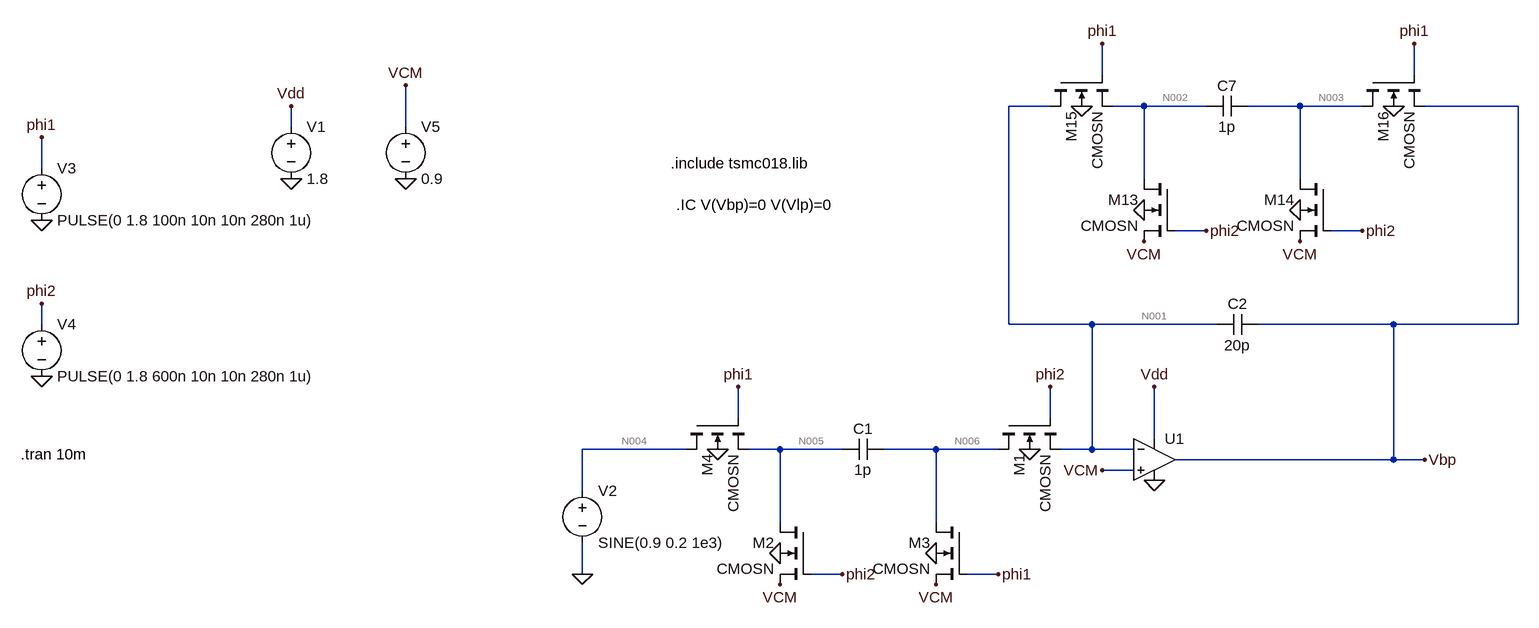
[diagram p0: schematic filtro1G2.asc]
filtro1G2.asc, the LTspice schematic file:
Version 4
SHEET 1 3232 680
WIRE 384 -368 384 -416
WIRE 864 -368 864 -416
WIRE 304 -320 240 -320
WIRE 448 -320 400 -320
WIRE 544 -320 448 -320
WIRE 688 -320 608 -320
WIRE 784 -320 688 -320
WIRE 1024 -320 880 -320
WIRE -864 -288 -864 -320
WIRE -688 -288 -688 -352
WIRE -1248 -224 -1248 -272
WIRE 448 -208 448 -320
WIRE 688 -208 688 -320
WIRE 544 -128 496 -128
WIRE 784 -128 736 -128
WIRE 448 -112 448 -128
WIRE -1248 16 -1248 -16
WIRE 240 16 240 -320
WIRE 368 16 240 16
WIRE 560 16 368 16
WIRE 832 16 624 16
WIRE 1024 16 1024 -320
WIRE 1024 16 832 16
WIRE -176 160 -176 112
WIRE 304 160 304 112
WIRE 464 192 464 112
WIRE -256 208 -416 208
WIRE -112 208 -160 208
WIRE -16 208 -112 208
WIRE 128 208 48 208
WIRE 224 208 128 208
WIRE 368 208 368 16
WIRE 368 208 320 208
WIRE 432 208 368 208
WIRE 832 224 832 16
WIRE 832 224 496 224
WIRE 880 224 832 224
WIRE 432 240 384 240
WIRE -416 272 -416 208
WIRE -112 320 -112 208
WIRE 128 320 128 208
WIRE -416 400 -416 352
WIRE -16 400 -64 400
WIRE 224 400 176 400
WIRE -112 416 -112 400
FLAG 464 256 0
FLAG -864 -208 0
FLAG -864 -320 Vdd
FLAG 464 112 Vdd
FLAG -1248 96 0
FLAG -1248 -144 0
FLAG -1248 -272 phi1
FLAG -176 112 phi1
FLAG -1248 -16 phi2
FLAG -208 208 0
FLAG -112 368 0
FLAG 128 368 0
FLAG 272 208 0
FLAG -16 400 phi2
FLAG 384 -416 phi1
FLAG 352 -320 0
FLAG 448 -160 0
FLAG 688 -160 0
FLAG 832 -320 0
FLAG 864 -416 phi1
FLAG 544 -128 phi2
FLAG 784 -128 phi2
FLAG 880 224 Vbp
FLAG -416 400 0
FLAG -688 -208 0
FLAG -688 -352 VCM
FLAG 384 240 VCM
FLAG -112 416 VCM
FLAG 128 416 VCM
FLAG 448 -112 VCM
FLAG 688 -112 VCM
FLAG 224 400 phi1
FLAG 304 112 phi2
SYMBOL OpAmps\\UniversalOpAmp2 464 224 R0
SYMATTR InstName U1
SYMATTR Value2 Avol=1Meg GBW=10Meg Slew=100Meg
SYMATTR SpiceLine2 En=0 Enk=0 In=0 Ink=0 Rin=5000Meg
SYMBOL cap 48 192 R90
WINDOW 0 0 32 VBottom 2
WINDOW 3 32 32 VTop 2
SYMATTR InstName C1
SYMATTR Value 1p
SYMBOL voltage -864 -304 R0
WINDOW 123 0 0 Left 0
WINDOW 39 0 0 Left 0
SYMATTR InstName V1
SYMATTR Value 1.8
SYMBOL voltage -1248 -240 R0
WINDOW 123 0 0 Left 0
WINDOW 39 0 0 Left 0
SYMATTR InstName V3
SYMATTR Value PULSE(0 1.8 100n 10n 10n 280n 1u)
SYMBOL cap 624 0 R90
WINDOW 0 0 32 VBottom 2
WINDOW 3 32 32 VTop 2
SYMATTR InstName C2
SYMATTR Value 20p
SYMBOL voltage -1248 0 R0
WINDOW 123 0 0 Left 0
WINDOW 39 0 0 Left 0
SYMATTR InstName V4
SYMATTR Value PULSE(0 1.8 600n 10n 10n 280n 1u)
SYMBOL cmosn -64 320 M0
SYMATTR InstName M2
SYMATTR Value2 l=500n w=2u
SYMBOL cmosn 176 320 M0
SYMATTR InstName M3
SYMATTR Value2 l=500n w=2u
SYMBOL cmosn -256 160 M90
SYMATTR InstName M4
SYMATTR Value2 l=500n w=2u
SYMBOL cmosn 224 160 M90
SYMATTR InstName M1
SYMATTR Value2 l=500n w=2u
SYMBOL cap 608 -336 R90
WINDOW 0 0 32 VBottom 2
WINDOW 3 32 32 VTop 2
SYMATTR InstName C7
SYMATTR Value 1p
SYMBOL cmosn 496 -208 M0
SYMATTR InstName M13
SYMATTR Value2 l=500n w=2u
SYMBOL cmosn 736 -208 M0
SYMATTR InstName M14
SYMATTR Value2 l=500n w=2u
SYMBOL cmosn 304 -368 M90
SYMATTR InstName M15
SYMATTR Value2 l=500n w=2u
SYMBOL cmosn 784 -368 M90
SYMATTR InstName M16
SYMATTR Value2 l=500n w=2u
SYMBOL voltage -416 256 R0
WINDOW 123 0 0 Left 0
WINDOW 39 0 0 Left 0
SYMATTR InstName V2
SYMATTR Value SINE(0.9 0.2 1e3)
SYMBOL voltage -688 -304 R0
WINDOW 123 0 0 Left 0
WINDOW 39 0 0 Left 0
SYMATTR InstName V5
SYMATTR Value 0.9
TEXT -280 -232 Left 2 !.include tsmc018.lib
TEXT -1280 216 Left 2 !.tran 10m
TEXT -272 -168 Left 2 !.IC V(Vbp)=0 V(Vlp)=0

The netlist it stands for:
* filtro1G2.asc
XU1 VCM N001 Vdd 0 Vbp level2 Avol=1Meg GBW=10Meg Slew=100Meg Ilimit=25m Rail=0 Vos=0 En=0 Enk=0 In=0 Ink=0 Rin=5000Meg  ; pins In+ In- V+ V- OUT
C1 N006 N005 1p
V1 Vdd 0 1.8
V3 phi1 0 PULSE(0 1.8 100n 10n 10n 280n 1u)
C2 Vbp N001 20p
V4 phi2 0 PULSE(0 1.8 600n 10n 10n 280n 1u)
M2 N005 phi2 VCM 0 CMOSN l=500n w=2u
M3 N006 phi1 VCM 0 CMOSN l=500n w=2u
M4 N004 phi1 N005 0 CMOSN l=500n w=2u
M1 N006 phi2 N001 0 CMOSN l=500n w=2u
C7 N003 N002 1p
M13 N002 phi2 VCM 0 CMOSN l=500n w=2u
M14 N003 phi2 VCM 0 CMOSN l=500n w=2u
M15 N001 phi1 N002 0 CMOSN l=500n w=2u
M16 N003 phi1 Vbp 0 CMOSN l=500n w=2u
V2 N004 0 SINE(0.9 0.2 1e3)
V5 VCM 0 0.9
.model NMOS NMOS
.model PMOS PMOS
.lib standard.mos
.include tsmc018.lib
.tran 10m
.IC V(Vbp)=0 V(Vlp)=0
.lib UniversalOpAmp2.lib
.backanno
.end

* Results of the author's LTspice run, read from the files saved beside the schematic
* Operating Point, zero values left out:
*   V(vdd) = 1.8 V
*   V(n001) = 889.8 mV
*   V(vcm) = 900 mV
*   V(n006) = 109.9 mV
*   V(n005) = 109.9 mV
*   V(n004) = 900 mV
*   V(n003) = 19.47 mV
*   V(n002) = 109.9 mV
*   Id(M16) = 3.768 pA
*   Is(M16) = -3.743 pA
*   Id(M15) = 1.019 pA
*   Ib(M15) = -1.02 pA
*   Id(M14) = -3.768 pA
*   Is(M14) = 4.702 pA
*   Ib(M13) = -1.03 pA
*   Is(M13) = 1.03 pA
*   Ib(M1) = -1.02 pA
*   Is(M1) = 1.019 pA
*   Id(M4) = 1.03 pA
*   Ib(M4) = -1.03 pA
*   Ib(M3) = -1.03 pA
*   Is(M3) = 1.03 pA
*   Ib(M2) = -1.03 pA
*   Is(M2) = 1.03 pA
*   I(V5) = -7.792 pA
*   I(V2) = -1.03 pA
*   I(V1) = -25 mA
*   Ix(u1:2) = -2.039 pA
*   Ix(u1:3) = 25 mA
*   Ix(u1:4) = -10.76 nA
*   Ix(u1:5) = -25 mA